# Altium schematic sheet EPS_5V.SchDoc: 5V
size A4; SheetNumber: 43; SheetTotal: 51
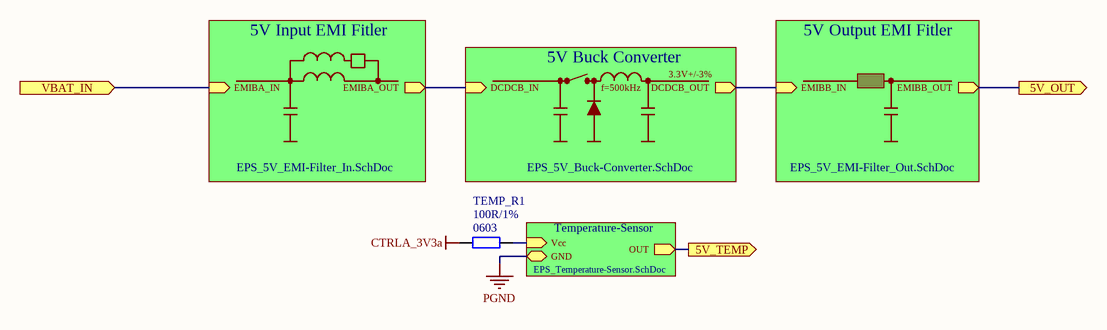
[diagram p0: EPS_5V.SchDoc]

## Parts
TEMP_R1  Package: 0603  [SMD_Resistor_0603]  (hidden comment: 100R/1%)

## Sub-sheets
5V Buck Converter = EPS_5V_Buck-Converter.SchDoc: DCDCB_OUT (out), DCDCB_IN (in)
5V Input EMI Fitler = EPS_5V_EMI-Filter_In.SchDoc: EMIBA_OUT (out), EMIBA_IN (in)
5V Output EMI Fitler = EPS_5V_EMI-Filter_Out.SchDoc: EMIBB_IN (in), EMIBB_OUT (out)
Temperature-Sensor = EPS_Temperature-Sensor.SchDoc: OUT (out), Vcc (in), GND

## Ports
5V_OUT (out), 5V_TEMP (out), VBAT_IN (in)

## Nets
CTRLA_3V3a: TEMP_R1.2
PGND: sheet Temperature-Sensor/GND
5V_OUT: port 5V_OUT, sheet 5V Output EMI Fitler/EMIBB_OUT
5V_TEMP: port 5V_TEMP, sheet Temperature-Sensor/OUT
VBAT_IN: port VBAT_IN, sheet 5V Input EMI Fitler/EMIBA_IN
NetTEMP_R1_1: TEMP_R1.1 ; sheet Temperature-Sensor/Vcc
(unnamed): sheet 5V Buck Converter/DCDCB_OUT, sheet 5V Output EMI Fitler/EMIBB_IN
(unnamed): sheet 5V Buck Converter/DCDCB_IN, sheet 5V Input EMI Fitler/EMIBA_OUT

## Notes on the sheet
- 3.3V+/-3%
- f=500kHz
- Title:
- Project:
- Author:
- Model:
- Document Number:
- Checked by:
- Rev:
- Date:
- Approved by:
- Sheet:
- of
- File name:

## Library data of the parts
TEMP_R1 = CRCW06031K00FKxxxx: 1k/1% Vishay CRCW 0603 Resistor. 100mW, 100ppm, 75V.; Manufacturer: Vishay; ManufacturerPartNumber: CRCW06031K00FKxxxx; Value: 100R/1%